# Altium schematic sheet MCU_core.SchDoc
size A4 portrait
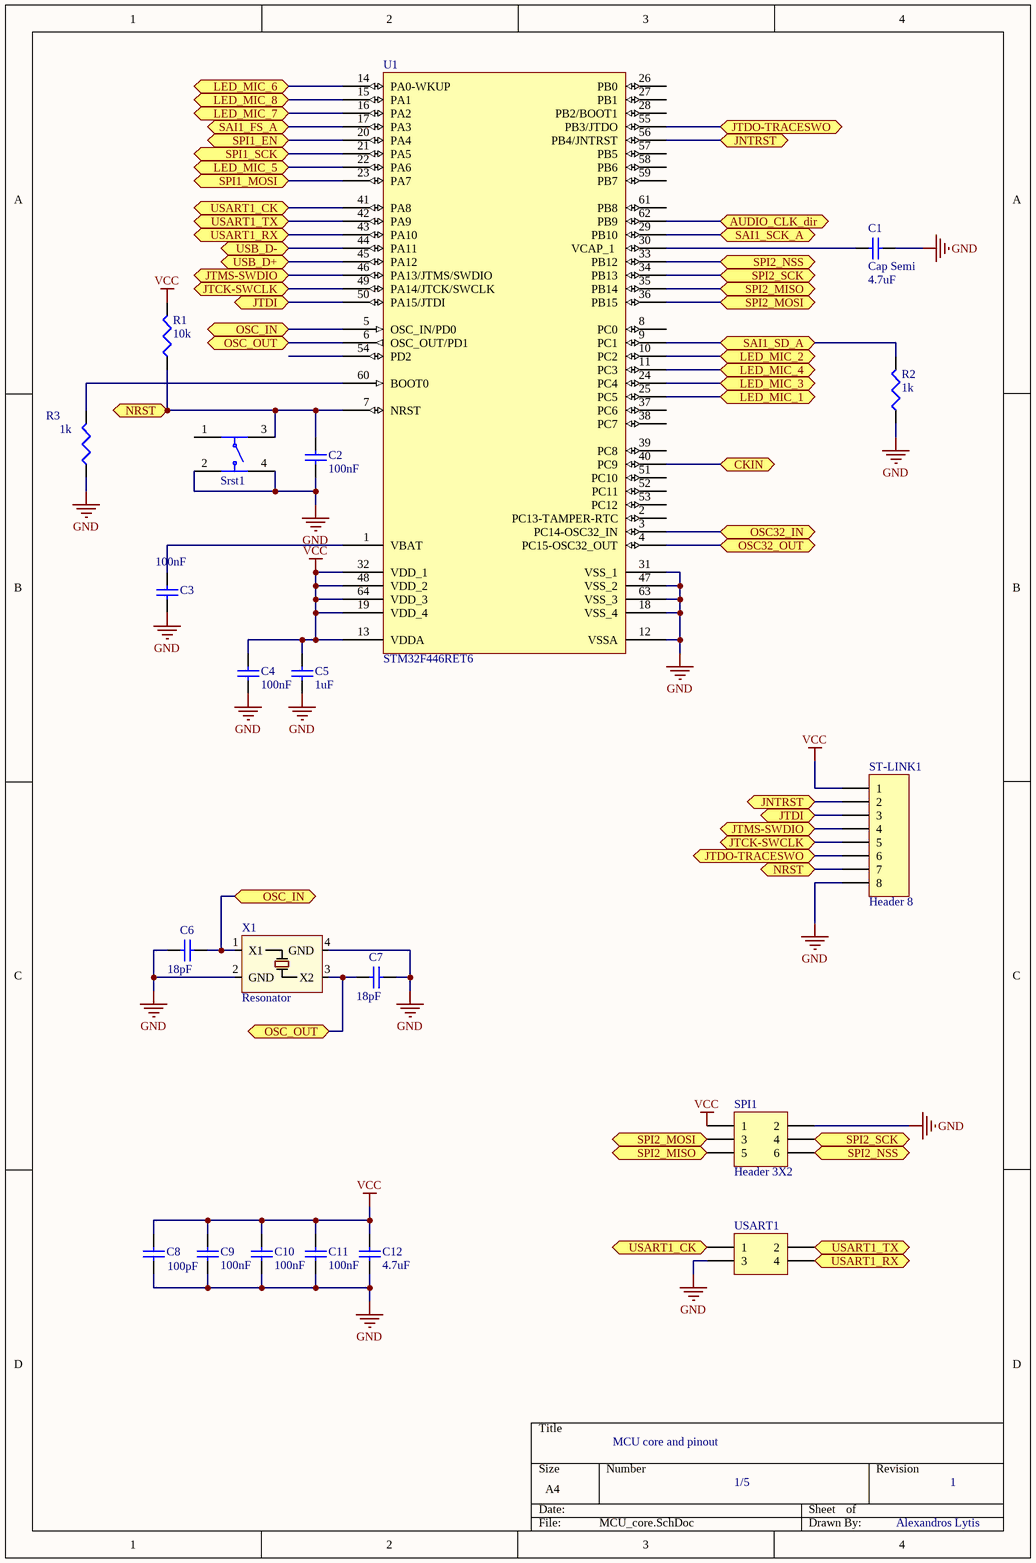
[diagram p0: MCU_core.SchDoc]

## Parts
C1  Cap Semi  value 4.7uF  [CAP0603]
C2  value 100nF  [CAP0603]  (hidden comment: Cap Semi)
C3  value 100nF  [CAP0603]  (hidden comment: Cap Semi)
C4  value 100nF  [CAP0603]  (hidden comment: Cap Semi)
C5  value 1uF  [CAP0603]  (hidden comment: Cap Semi)
C6  value 18pF  [CAP0603]  (hidden comment: Cap Semi)
C7  value 18pF  [CAP0603]  (hidden comment: Cap Semi)
C8  value 100pF  [CAP0603]  (hidden comment: Cap Semi)
C9  value 100nF  [CAP0603]  (hidden comment: Cap Semi)
C10  value 100nF  [CAP0603]  (hidden comment: Cap Semi)
C11  value 100nF  [CAP0603]  (hidden comment: Cap Semi)
C12  value 4.7uF  [CAP0603]  (hidden comment: Cap Semi)
R1  value 10k  [RES0603]  (hidden comment: Res3)
R2  value 1k  [RES0603]  (hidden comment: Res3)
R3  value 1k  [RES0603]  (hidden comment: Res3)
SPI1  Header 3X2  [HDR2X3]
Srst1  430152043826  [4301x20438x6]  (value not drawn)
ST-LINK1  Header 8  [HDR1X8]
U1  STM32F446RET6  [LQFP64_N]
USART1  Header 2X2  [HDR2X2]  (value not drawn)
X1  Resonator  [ABM8G]

## Ports
AUDIO_CLK_dir, CKIN, JNTRST, JTCK-SWCLK, JTDI, JTDO-TRACESWO, JTMS-SWDIO, LED_MIC_1, LED_MIC_2, LED_MIC_3, LED_MIC_4, LED_MIC_5, LED_MIC_6, LED_MIC_7, LED_MIC_8, NRST, OSC32_IN, OSC32_OUT, OSC_IN, OSC_OUT, SAI1_FS_A, SAI1_SCK_A, SAI1_SD_A, SPI1_EN, SPI1_MOSI, SPI1_SCK, SPI2_MISO, SPI2_MOSI, SPI2_NSS, SPI2_SCK, USART1_CK, USART1_RX, USART1_TX, USB_D+, USB_D-

## Nets
GND: C1.2 C2.1 C3.1 C4.1 C5.1 C6.1 C7.2 C8.1 C9.1 C10.1 C11.1 C12.1 R2.1 R3.1 SPI1.2 Srst1.2 Srst1.4 ST-LINK1.8 U1.12(VSSA) U1.18(VSS_4) U1.31(VSS_1) U1.47(VSS_2) U1.63(VSS_3) USART1.3 X1.2(GND) X1.4(GND)
VCC: C4.2 C5.2 C8.2 C9.2 C10.2 C11.2 C12.2 R1.2 SPI1.1 ST-LINK1.1 U1.13(VDDA) U1.19(VDD_4) U1.32(VDD_1) U1.48(VDD_2) U1.64(VDD_3)
AUDIO_CLK_dir: U1.62(PB9) ; port AUDIO_CLK_dir
CKIN: U1.40(PC9) ; port CKIN
JNTRST: ST-LINK1.2 U1.56(PB4/JNTRST) ; port JNTRST
JTCK-SWCLK: ST-LINK1.5 U1.49(PA14/JTCK/SWCLK) ; port JTCK-SWCLK
JTDI: ST-LINK1.3 U1.50(PA15/JTDI) ; port JTDI
JTDO-TRACESWO: ST-LINK1.6 U1.55(PB3/JTDO) ; port JTDO-TRACESWO
JTMS-SWDIO: ST-LINK1.4 U1.46(PA13/JTMS/SWDIO) ; port JTMS-SWDIO
LED_MIC_1: U1.25(PC5) ; port LED_MIC_1
LED_MIC_2: U1.10(PC2) ; port LED_MIC_2
LED_MIC_3: U1.24(PC4) ; port LED_MIC_3
LED_MIC_4: U1.11(PC3) ; port LED_MIC_4
LED_MIC_5: U1.22(PA6) ; port LED_MIC_5
LED_MIC_6: U1.14(PA0-WKUP) ; port LED_MIC_6
LED_MIC_7: U1.16(PA2) ; port LED_MIC_7
LED_MIC_8: U1.15(PA1) ; port LED_MIC_8
NRST: C2.2 R1.1 Srst1.3 ST-LINK1.7 U1.7(NRST) ; port NRST
OSC32_IN: U1.3(PC14-OSC32_IN) ; port OSC32_IN
OSC32_OUT: U1.4(PC15-OSC32_OUT) ; port OSC32_OUT
OSC_IN: C6.2 U1.5(OSC_IN/PD0) X1.1(X1) ; port OSC_IN
OSC_OUT: C7.1 U1.6(OSC_OUT/PD1) X1.3(X2) ; port OSC_OUT
SAI1_FS_A: U1.17(PA3) ; port SAI1_FS_A
SAI1_SCK_A: U1.29(PB10) ; port SAI1_SCK_A
SAI1_SD_A: R2.2 U1.9(PC1) ; port SAI1_SD_A
SPI1_EN: U1.20(PA4) ; port SPI1_EN
SPI1_MOSI: U1.23(PA7) ; port SPI1_MOSI
SPI1_SCK: U1.21(PA5) ; port SPI1_SCK
SPI2_MISO: SPI1.5 U1.35(PB14) ; port SPI2_MISO
SPI2_MOSI: SPI1.3 U1.36(PB15) ; port SPI2_MOSI
SPI2_NSS: SPI1.6 U1.33(PB12) ; port SPI2_NSS
SPI2_SCK: SPI1.4 U1.34(PB13) ; port SPI2_SCK
USART1_CK: U1.41(PA8) USART1.1 ; port USART1_CK
USART1_RX: U1.43(PA10) USART1.4 ; port USART1_RX
USART1_TX: U1.42(PA9) USART1.2 ; port USART1_TX
USB_D+: U1.45(PA12) ; port USB_D+
USB_D-: U1.44(PA11) ; port USB_D-
NetC1_1: C1.1 U1.30(VCAP_1)
NetC3_2: C3.2 U1.1(VBAT)
NetR3_2: R3.2 U1.60(BOOT0)

Not connected (* = marked no-connect by the designer): Srst1 1; U1 2(PC13-TAMPER-RTC) 8(PC0) 26(PB0) 27(PB1) 28(PB2/BOOT1) 37(PC6) 38(PC7) 39(PC8) 51(PC10) 52(PC11) 53(PC12) 54(PD2) 57(PB5) 58(PB6) 59(PB7) 61(PB8)

## Notes on the sheet
- MCU core and pinout
- 1/5
- 1
- Alexandros Lytis

## Library data of the parts
C1-C12 = Cap Semi: Capacitor (Semiconductor SIM Model); Published: 8-Jun-2000; LatestRevisionDate: 29-May-2009; LatestRevisionNote: IPC-7351 Footprint Added.; PackageReference: C1206; Publisher: Altium Limited; PackageDescription: Chip Capacitor
R1-R3 = Res3: Resistor; Published: 8-Jun-2000; LatestRevisionDate: 29-May-2009; LatestRevisionNote: IPC-7351 Footprint Added.; PackageReference: J1-0603; Publisher: Altium Limited; PackageDescription: Chip Resistor
SPI1 = Header 3X2: Header, 3-Pin, Dual row; LatestRevisionDate: 17-Jul-2002; LatestRevisionNote: Re-released for DXP Platform.; Publisher: Altium Limited
Srst1 = WS-TASV, 430152043826: WS-TASV 6x6 mm SMD; Manufacturer: Wurth Elektronik; partNo: 430152043826; ComponentLink1Description: Manufacturer; ComponentLink1URL: http://www.we-online.de; Created by: Baojun Chen; Created Date: Dec.2015; ComponentLink2Description: Datasheet; ComponentLink2URL: http://katalog.we-online.de/em/datasheet/4301x2xxx8x6.pdf
ST-LINK1 = Header 8: Header, 8-Pin; LatestRevisionDate: 17-Jul-2002; LatestRevisionNote: Re-released for DXP Platform.; Publisher: Altium Limited
U1 = STM32F101RBT6: STM32 ARM-based 32-bit MCU with 128 Kbytes Flash, 64-pin LQFP, Industrial Temperature; Published: 30-May-2008; DatasheetVersion: rev6, Mar-2008; PackageVersion: Mar-2008; PackageReference: LQFP64; Publisher: Altium Limited; PackageDescription: 64-Pin Low-Profile Quad Flat Pack, 10 x 10 mm Body, 0.5 mm Pitch (LQFP64); ComponentLink1Description: Manufacturer Link; ComponentLink1URL: www.st.com/stm32; ComponentLink2Description: Datasheet; ComponentLink2URL: http://www.st.com/stonline/products/literature/ds/13586.pdf
USART1 = Header 2X2: Header, 2-Pin, Dual row; LatestRevisionDate: 17-Jul-2002; LatestRevisionNote: Re-released for DXP Platform.; Publisher: Altium Limited
X1 = ABM8G-MHz: Part Nubmer: ABM8G-12.288MHZ-4Y-T3